# Altium schematic sheet Generator40.SchDoc
size 420 x 297 mm; DocumentNumber: Audio core
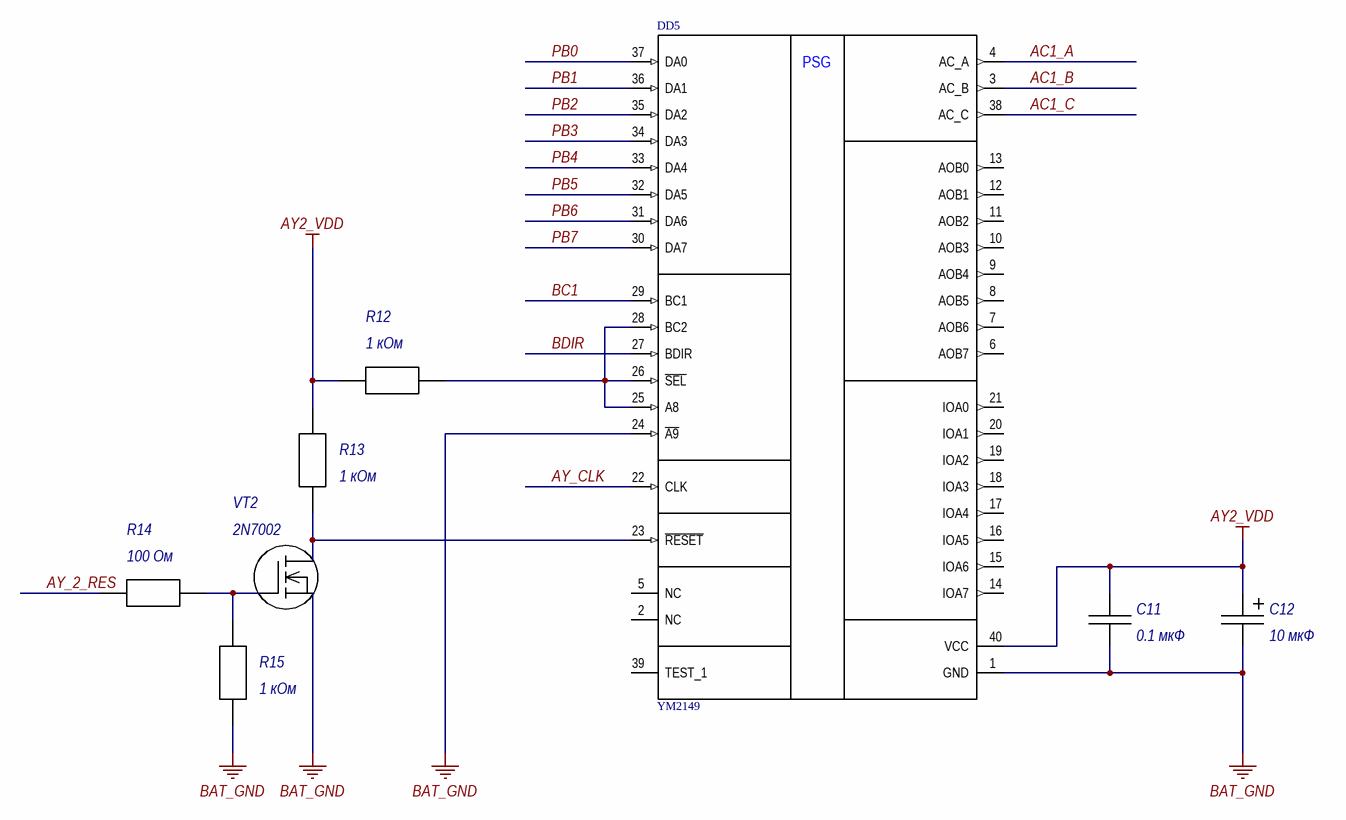
[diagram p0: Generator40.SchDoc]

## Parts
C11  0.1 мкФ  [C 1206]
C12  10 мкФ  [C TAN_A]
DD5  YM2149  [DIP40_PLUS_MCU]
R12  1 кОм  [RES 0805]
R13  1 кОм  [RES 0805]
R14  100 Ом  [RES 0805]
R15  1 кОм  [RES 0805]
VT2  2N7002  [SOT-23]

## Nets
AY2_VDD: C11.1 C12.1 DD5.40(VCC) R12.2 R13.2
BAT_GND: C11.2 C12.2 DD5.1(GND) DD5.24(~{A9}) R15.1 VT2.2(S)
AC1_A: DD5.4(AC_A)
AC1_B: DD5.3(AC_B)
AC1_C: DD5.38(AC_C)
AY_2_RES: R14.1
AY_CLK: DD5.22(CLK)
BC1: DD5.29(BC1)
BDIR: DD5.27(BDIR)
PB0: DD5.37(DA0)
PB1: DD5.36(DA1)
PB2: DD5.35(DA2)
PB3: DD5.34(DA3)
PB4: DD5.33(DA4)
PB5: DD5.32(DA5)
PB6: DD5.31(DA6)
PB7: DD5.30(DA7)
NetDD5_23: DD5.23(~{RESET}) R13.1 VT2.3(D)
NetDD5_25: DD5.25(A8) DD5.26(~{SEL}) DD5.28(BC2) R12.1
NetR14_2: R14.2 R15.2 VT2.1(G)

Not connected (* = marked no-connect by the designer): DD5 2(NC) 5(NC) 6(AOB7) 7(AOB6) 8(AOB5) 9(AOB4) 10(AOB3) 11(AOB2) 12(AOB1) 13(AOB0) 14(IOA7) 15(IOA6) 16(IOA5) 17(IOA4) 18(IOA3) 19(IOA2) 20(IOA1) 21(IOA0) 39(TEST_1)

## Notes on the sheet
- Подп. и дата
- Инв. № дубл.
- Взам. инв. №
- Инв. № подл.
- Лист
- Изм.
- № докум.
- Подп.
- Дата
- Копировал
- Формат А3
- (in symbol YM2149) PSG

## Library data of the parts
C11 = CAP 1206: SMD Capacitor 1206; Manufacturer: /Укажите компанию-производителя/; Tolerance: /Укажите допуск в процентах/; Temperature coefficient: /Формат: ±? ppm/°C/; Type: Конденсатор керамический; TC: /Укажите тип диэлектрика/; Size: 1206; Temperature range: /Формат: -? ... ? °C/; Value: 0.1 мкФ
C12 = CAP TAN_A: SMD Tantalium Capacitor A; Type: Конденсатор танталовый; Rated voltage: 10 В; Size: A
R12-R15 = RES 0805
VT2 = 2N7002: 60 V, 300 mA N-channel Trench MOSFET; Manufacturer: NXP; Structure: Индуцированный канал n-типа; Type: Транзистор полевой с изолированным затвором; Max gate-to-source voltage: 30 В; Drain-to-source breakdown voltage: 60 В; Gate threshold voltage: 2 В; Max continuous drain current: 300 мА; Max pulsed drain current: 1,2 А; Power dissitipation: 0,83 Вт; Input capacitance: 31 пФ; Output capacitance: 6,8 пФ; Turn-on time: 2,5 нс; Reverse transfer capacitance: 3,5 пФ; Turn-off time: 11 нс; Rds: 2,8 Ом; Temperature range: -65 ... 150 °C